# EAGLE design interfaces (EAGLE 7.7.0)
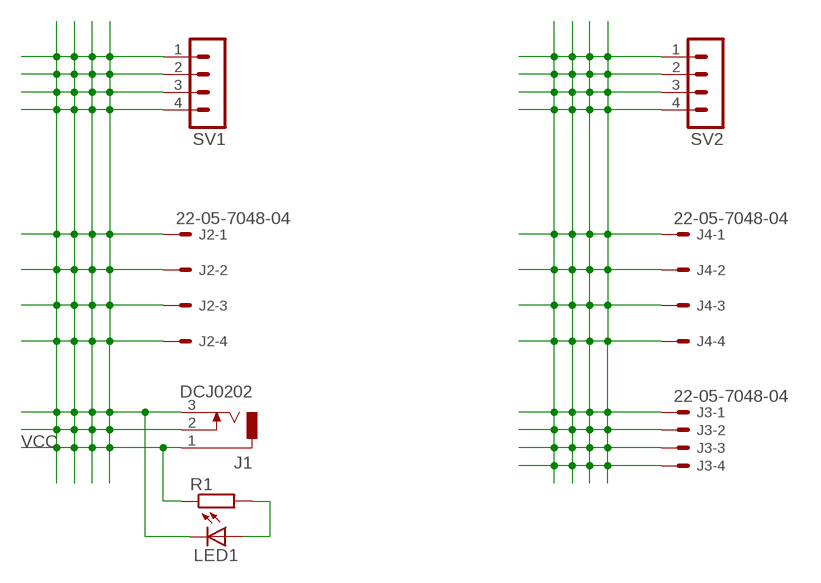
[diagram p0: schematic, sheet 1]

## Parts
J1  DCJ0202  [DCJ0202]
J2  22-05-7048-04  [7395-04]
J3  22-05-7048-04  [7395-04]
J4  22-05-7048-04  [7395-04]
LED1  LEDSML0805  [SML0805]
R1  R-EU_R0805  [R0805]
SV1  MA04-1  [MA04-1]
SV2  MA04-1  [MA04-1]

## Nets
N$1: LED1.A R1.2
N$2: J3.1 J3.2 J3.3 J3.4 J4.1 J4.2 J4.3 J4.4 SV2.1 SV2.2 SV2.3 SV2.4
VCC: J1.1 J1.2 J1.3 J2.1 J2.2 J2.3 J2.4 LED1.C R1.1 SV1.1 SV1.2 SV1.3 SV1.4

## Library data of the parts
J1 = con-jack:DCJ0202: DC POWER JACK Source: DCJ0202.pdf; OC_FARNELL: unknown; OC_NEWARK: unknown
J2-J4 = con-molex:22-?-04: CONNECTOR wire to board 2.54 mm (.1 inch) pitch header; OC_FARNELL: unknown; OC_NEWARK: unknown
LED1 = led:LED: LED OSRAM: - CHIPLED LG R971, LG N971, LY N971, LG Q971, LY Q971, LO R971, LY R971 LH N974, LH R974 LS Q976, LO Q976, LY Q976 LO Q996 - Hyper CHIPLED LW Q18S LB Q993, LB Q99A, LB R99A - SideLED LS A670, LO A670, LY A670, LG A670, LP A670 LB A673, LV A673, LT A673, LW A673 LH A674 LY A675 LS A676, LA A676, LO A676, LY A676, LW A676 LS A679, LY A679, LG A679 - Hyper Micro SIDELED® LS Y876, LA Y876, LO Y876, LY Y876 LT Y87S - SmartLED LW L88C, LW L88S LB L89C, LB L89S, LG L890 LS L89K, LO L89K, LY L89K LS L896, LA L896, LO L896, LY L896 - TOPLED LS T670, LO T670, LY T670, LG T670, LP T670 LSG T670, LSP T670, LSY T670, LOP T670, LYG T670 LG T671, LOG T671, LSG T671 LB T673, LV T673, LT T673, LW T673 LH T674 LS T676, LA T676, LO T676, LY T676, LB T676, LH T676, LSB T676, LW T676 LB T67C, LV T67C, LT T67C, LS T67K, LO T67K, LY T67K, LW E67C LS E67B, LA E67B, LO E67B, LY E67B, LB E67C, LV E67C, LT E67C LW T67C LS T679, LY T679, LG T679 LS T770, LO T770, LY T770, LG T770, LP T770 LB T773, LV T773, LT T773, LW T773 LH T774 LS E675, LA E675, LY E675, LS T675 LS T776, LA T776, LO T776, LY T776, LB T776 LHGB T686 LT T68C, LB T68C - Hyper Mini TOPLED® LB M676 - Mini TOPLED Santana® LG M470 LS M47K, LO M47K, LY M47K Source: http://www.osram.convergy.de LUXEON: - LUMILED® LXK2-PW12-R00, LXK2-PW12-S00, LXK2-PW14-U00, LXK2-PW14-V00 LXK2-PM12-R00, LXK2-PM12-S00, LXK2-PM14-U00 LXK2-PE12-Q00, LXK2-PE12-R00, LXK2-PE12-S00, LXK2-PE14-T00, LXK2-PE14-U00 LXK2-PB12-K00, LXK2-PB12-L00, LXK2-PB12-M00, LXK2-PB14-N00, LXK2-PB14-P00, LXK2-PB14-Q00 LXK2-PR12-L00, LXK2-PR12-M00, LXK2-PR14-Q00, LXK2-PR14-R00 LXK2-PD12-Q00, LXK2-PD12-R00, LXK2-PD12-S00 LXK2-PH12-R00, LXK2-PH12-S00 LXK2-PL12-P00, LXK2-PL12-Q00, LXK2-PL12-R00 Source: www.luxeon.com KINGBRIGHT: KA-3528ASYC Source: www.kingbright.com
R1 = rcl:R-EU_: RESISTOR, European symbol
SV1 SV2 = con-lstb:MA04-1: PIN HEADER; OC_FARNELL: unknown; OC_NEWARK: unknown

## Board
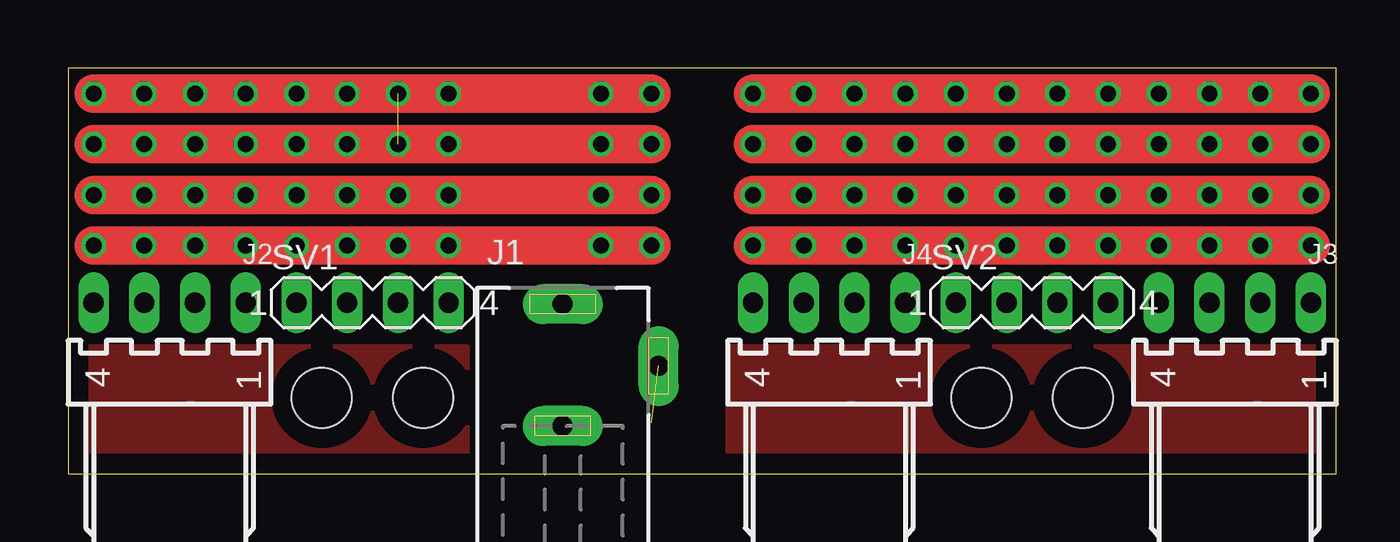
[diagram p1: board, top side]
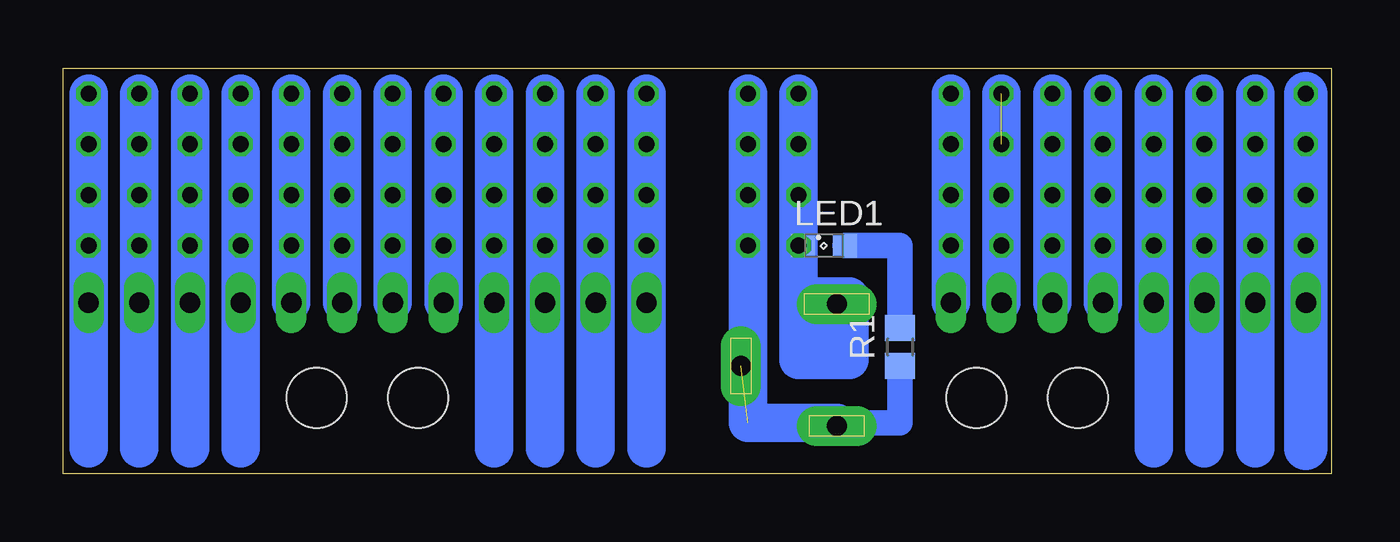
[diagram p2: board, bottom side, seen from below]

Size 63.49 x 20.31 mm. Coordinates in mm from the lower left corner, seen from the top.
Outline: 0,0 63.49,0 63.49,20.31 0,20.31 0,0
Copper layers (1*16): Top 0.035mm / dielectric 1.5mm / Bottom 0.035mm
Design rules "default": minimum track width 10mil, minimum drill 24mil, track to track 8mil, track to pad 8mil, pad to pad 8mil, via to via 8mil, smd to smd 8mil, copper to edge 40mil, drill to drill 8mil, minimum pad ring 10mil, minimum via ring 8mil, stop-mask expansion 4mil, vias tented up to drill 0mil, thermal gap 10mil
Holes 3 mm at 17.78,3.81 12.7,3.81 50.8,3.81 45.72,3.81

### Footprints (pad centres in the part's own frame; a part is rotated, then mirrored left to right if it is on the bottom)
DCJ0202 = drill 1 pad 2 long: 1 0,3.1; 2 4.8,0; 3 0,-3
7395-04 = drill 1.016 long: 1 3.81,0; 2 1.27,0; 3 -1.27,0; 4 -3.81,0
SML0805 = smd 1.2 x 1.2: A 1.05,0; C -1.05,0
R0805 = smd 1.3 x 1.5: 1 -0.95,0; 2 0.95,0
MA04-1 = drill 1.016 long: 1 -3.81,0; 2 -1.27,0; 3 1.27,0; 4 3.81,0

### Placement (x,y rotation side)
J1  24.77,5.4 0 top
J2  5.08,8.57 0 top
J3  58.42,8.57 0 top
J4  38.1,8.57 0 top
LED1  25.4,11.43 0 bottom
R1  21.59,6.35 90 bottom
SV1  15.24,8.57 0 top
SV2  48.26,8.57 0 top

### Tracks (layer width: path | path; a pad name or v marks a point on that pad's centre or on a via)
N$1
  Bottom 1.27: R1.2 21.59,11.43 LED1.A
N$2  (via drill 0.8)
  Top 1.93: v62.23,19.05 v59.69,19.05 v57.15,19.05 v54.61,19.05 v52.07,19.05 v49.53,19.05 v46.99,19.05 v44.45,19.05 v41.91,19.05 v39.37,19.05 v36.83,19.05 v34.29,19.05 | v34.29,16.51 v36.83,16.51 v39.37,16.51 v41.91,16.51 v44.45,16.51 v46.99,16.51 v49.53,16.51 v52.07,16.51 v54.61,16.51 v57.15,16.51 v59.69,16.51 v62.23,16.51 | v62.23,13.97 v59.69,13.97 v57.15,13.97 v54.61,13.97 v52.07,13.97 v49.53,13.97 v46.99,13.97 v44.45,13.97 v41.91,13.97 v39.37,13.97 v36.83,13.97 v34.29,13.97 | v34.29,11.43 v36.83,11.43 v39.37,11.43 v41.91,11.43 v44.45,11.43 v46.99,11.43 v49.53,11.43 v52.07,11.43 v54.61,11.43 v57.15,11.43 v59.69,11.43 v62.23,11.43
  Bottom 1.93: 34.29,1.27 J4.4 v34.29,11.43 v34.29,13.97 v34.29,19.05 | 36.83,1.27 J4.3 v36.83,11.43 v36.83,13.97 v36.83,16.51 v36.83,19.05 | 39.37,1.27 J4.2 v39.37,11.43 v39.37,13.97 v39.37,16.51 v39.37,19.05 | SV2.4 v52.07,11.43 v52.07,13.97 v52.07,16.51 v52.07,19.05 | 54.61,1.27 J3.4 v54.61,11.43 v54.61,13.97 v54.61,16.51 v54.61,19.05 | 57.15,1.27 J3.3 v57.15,11.43 v57.15,13.97 v57.15,16.51 v57.15,19.05 | 59.69,1.27 J3.2 v59.69,11.43 v59.69,13.97 v59.69,16.51 v59.69,19.05 | 62.23,1.27 J3.1 v62.23,11.43 v62.23,13.97 v62.23,16.51 v62.23,19.05 | SV2.3 v49.53,11.43 v49.53,13.97 v49.53,16.51 v49.53,19.05 | SV2.2 v46.99,11.43 v46.99,13.97 v46.99,16.51 v46.99,19.05 | SV2.1 44.45,8.89 v44.45,11.43 v44.45,13.97 v44.45,16.51 v44.45,19.05 | 41.91,1.27 J4.1 v41.91,11.43 v41.91,13.97 v41.91,16.51 v41.91,19.05
N$3
  pour Top (isolate 0.254): 0,0 20,0 20,6.35 0,6.35
N$4
  pour Top (isolate 0.254): 33.02,0 63.5,0 63.5,6.35 33.02,6.35
VCC  (via drill 0.8)  (2 unrouted)
  Top 1.93: v1.27,19.05 v3.81,19.05 v6.35,19.05 v8.89,19.05 v11.43,19.05 v13.97,19.05 v16.51,19.05 v19.05,19.05 v26.67,19.05 v29.21,19.05 | v1.27,11.43 v3.81,11.43 v6.35,11.43 v8.89,11.43 v13.97,11.43 v16.51,11.43 v19.05,11.43 v26.67,11.43 v29.21,11.43 | v29.21,13.97 v26.67,13.97 v19.05,13.97 v16.51,13.97 v13.97,13.97 v11.43,13.97 v8.89,13.97 v6.35,13.97 v3.81,13.97 v1.27,13.97 | v1.27,16.51 v3.81,16.51 v6.35,16.51 v8.89,16.51 v11.43,16.51 v13.97,16.51 v19.05,16.51 v29.21,16.51
  Bottom 0.61: LED1.C v26.67,11.43 27.3,11.43
  Bottom 1.27: R1.1 21.59,2.54 24.13,2.54 24.13,2.71 J1.3
  Bottom 1.93: v3.81,19.05 v3.81,16.51 v3.81,13.97 v3.81,11.43 J2.3 3.81,1.27 | v6.35,19.05 v6.35,16.51 v6.35,13.97 v6.35,11.43 J2.2 6.35,1.27 | v8.89,19.05 v8.89,16.51 v8.89,13.97 v8.89,11.43 J2.1 8.89,1.27 | SV1.2 v13.97,11.43 v13.97,13.97 v13.97,16.51 v13.97,19.05 | SV1.4 v19.05,11.43 v19.05,13.97 v19.05,16.51 v19.05,19.05 | SV1.1 v11.43,11.43 v11.43,13.97 v11.43,16.51 v11.43,19.05 | J1.3 24.77,2.54 29.21,2.54 v29.21,11.43 v29.21,13.97 v29.21,16.51 v29.21,19.05 | J1.1 24.77,8.89 | 24.77,8.89 25.4,8.89 | 25.4,8.89 26.67,8.89 | SV1.3 v16.51,11.43 v16.51,13.97 v16.51,19.05 | 26.67,8.89 26.67,5.71 24.13,5.71 24.13,8.89 24.77,8.89 | 25.4,8.89 25.4,6.35 | v26.67,19.05 v26.67,16.51 v26.67,13.97 v26.67,11.43 26.67,8.89
  Bottom 2.184: v1.27,19.05 v1.27,16.51 v1.27,13.97 v1.27,11.43 J2.4 1.27,1.27
  other vias: 16.51,16.51